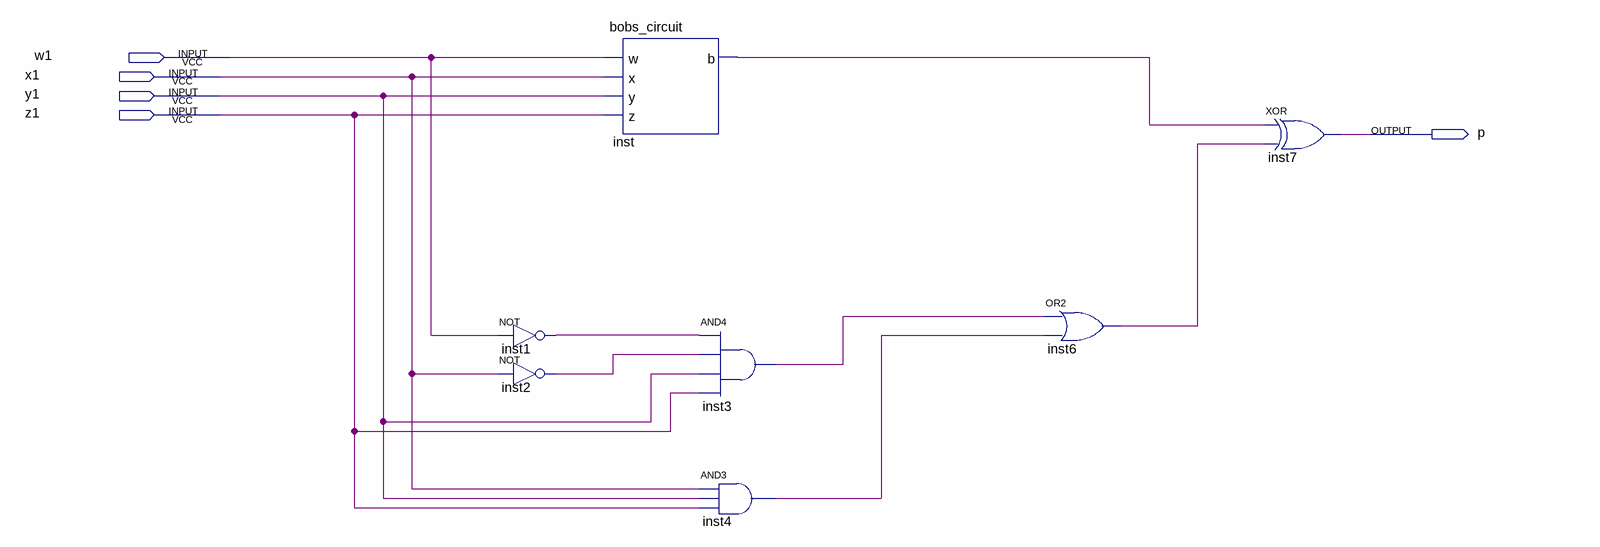
[diagram p0: schematic sheet]
// Quartus schematic m1step1.bdf as structural Verilog: 7 symbols, 5 pins
module m1step1 (
  input  w1,
  input  x1,
  input  y1,
  input  z1,
  output p
);

  wire inst1_out, inst2_out, inst3_out, inst4_out, inst6_out, inst_b;

  not inst1 (inst1_out, w1);
  not inst2 (inst2_out, x1);
  bobs_circuit inst (.w(w1), .x(x1), .y(y1), .z(z1), .b(inst_b));
  and inst3 (inst3_out, inst1_out, inst2_out, y1, z1);
  and inst4 (inst4_out, x1, y1, z1);
  or inst6 (inst6_out, inst3_out, inst4_out);
  xor inst7 (p, inst_b, inst6_out);
endmodule
